# EAGLE design rpi_board (EAGLE 9.3.2)
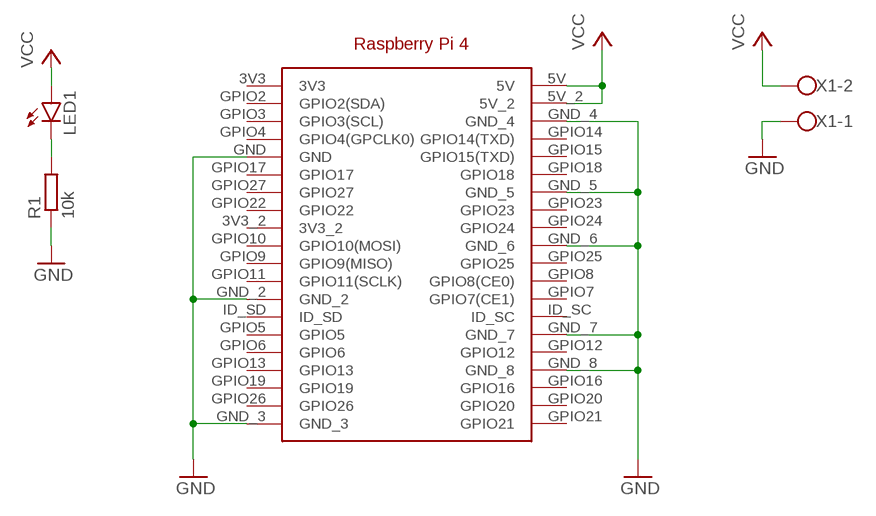
[diagram p0: schematic, sheet 1]

## Parts
LED1  LEDSMT1206  [1206]
R1  10k  R-EU_M1206  [M1206]
U$1  RPI_4  [RPI4_FOOTPRINT]
X1  W237-102  [W237-102]

## Nets
GND: R1.1 U$1.GND U$1.GND_2 U$1.GND_3 U$1.GND_4 U$1.GND_5 U$1.GND_6 U$1.GND_7 U$1.GND_8 X1.1
N$2: LED1.C R1.2
VCC: LED1.A U$1.5V U$1.5V_2 X1.2
Unconnected: U$1.3V3 U$1.3V3_2 U$1.GPIO2(GPIO2(SDA)) U$1.GPIO3(GPIO3(SCL)) U$1.GPIO4(GPIO4(GPCLK0)) U$1.GPIO5 U$1.GPIO6 U$1.GPIO7(GPIO7(CE1)) U$1.GPIO8(GPIO8(CE0)) U$1.GPIO9(GPIO9(MISO)) U$1.GPIO10(GPIO10(MOSI)) U$1.GPIO11(GPIO11(SCLK)) U$1.GPIO12 U$1.GPIO13 U$1.GPIO14(GPIO14(TXD)) U$1.GPIO15(GPIO15(TXD)) U$1.GPIO16 U$1.GPIO17 U$1.GPIO18 U$1.GPIO19 U$1.GPIO20 U$1.GPIO21 U$1.GPIO22 U$1.GPIO23 U$1.GPIO24 U$1.GPIO25 U$1.GPIO26 U$1.GPIO27 U$1.ID_SC U$1.ID_SD

## Library data of the parts
LED1 = led:LED: LED OSRAM: - CHIPLED LG R971, LG N971, LY N971, LG Q971, LY Q971, LO R971, LY R971 LH N974, LH R974 LS Q976, LO Q976, LY Q976 LO Q996 - Hyper CHIPLED LW Q18S LB Q993, LB Q99A, LB R99A - SideLED LS A670, LO A670, LY A670, LG A670, LP A670 LB A673, LV A673, LT A673, LW A673 LH A674 LY A675 LS A676, LA A676, LO A676, LY A676, LW A676 LS A679, LY A679, LG A679 - Hyper Micro SIDELED® LS Y876, LA Y876, LO Y876, LY Y876 LT Y87S - SmartLED LW L88C, LW L88S LB L89C, LB L89S, LG L890 LS L89K, LO L89K, LY L89K LS L896, LA L896, LO L896, LY L896 - TOPLED LS T670, LO T670, LY T670, LG T670, LP T670 LSG T670, LSP T670, LSY T670, LOP T670, LYG T670 LG T671, LOG T671, LSG T671 LB T673, LV T673, LT T673, LW T673 LH T674 LS T676, LA T676, LO T676, LY T676, LB T676, LH T676, LSB T676, LW T676 LB T67C, LV T67C, LT T67C, LS T67K, LO T67K, LY T67K, LW E67C LS E67B, LA E67B, LO E67B, LY E67B, LB E67C, LV E67C, LT E67C LW T67C LS T679, LY T679, LG T679 LS T770, LO T770, LY T770, LG T770, LP T770 LB T773, LV T773, LT T773, LW T773 LH T774 LS E675, LA E675, LY E675, LS T675 LS T776, LA T776, LO T776, LY T776, LB T776 LHGB T686 LT T68C, LB T68C - Hyper Mini TOPLED® LB M676 - Mini TOPLED Santana® LG M470 LS M47K, LO M47K, LY M47K Source: http://www.osram.convergy.de LUXEON: - LUMILED® LXK2-PW12-R00, LXK2-PW12-S00, LXK2-PW14-U00, LXK2-PW14-V00 LXK2-PM12-R00, LXK2-PM12-S00, LXK2-PM14-U00 LXK2-PE12-Q00, LXK2-PE12-R00, LXK2-PE12-S00, LXK2-PE14-T00, LXK2-PE14-U00 LXK2-PB12-K00, LXK2-PB12-L00, LXK2-PB12-M00, LXK2-PB14-N00, LXK2-PB14-P00, LXK2-PB14-Q00 LXK2-PR12-L00, LXK2-PR12-M00, LXK2-PR14-Q00, LXK2-PR14-R00 LXK2-PD12-Q00, LXK2-PD12-R00, LXK2-PD12-S00 LXK2-PH12-R00, LXK2-PH12-S00 LXK2-PL12-P00, LXK2-PL12-Q00, LXK2-PL12-R00 Source: www.luxeon.com KINGBRIGHT: KA-3528ASYC Source: www.kingbright.com
R1 = rcl:R-EU_: RESISTOR, European symbol; SPICEPREFIX: R
U$1 = rpi4:RPI_4
X1 = con-wago-500:W237-102: WAGO SCREW CLAMP; MPN: 237-102; OC_FARNELL: unknown; OC_NEWARK: 70K9898

## Board
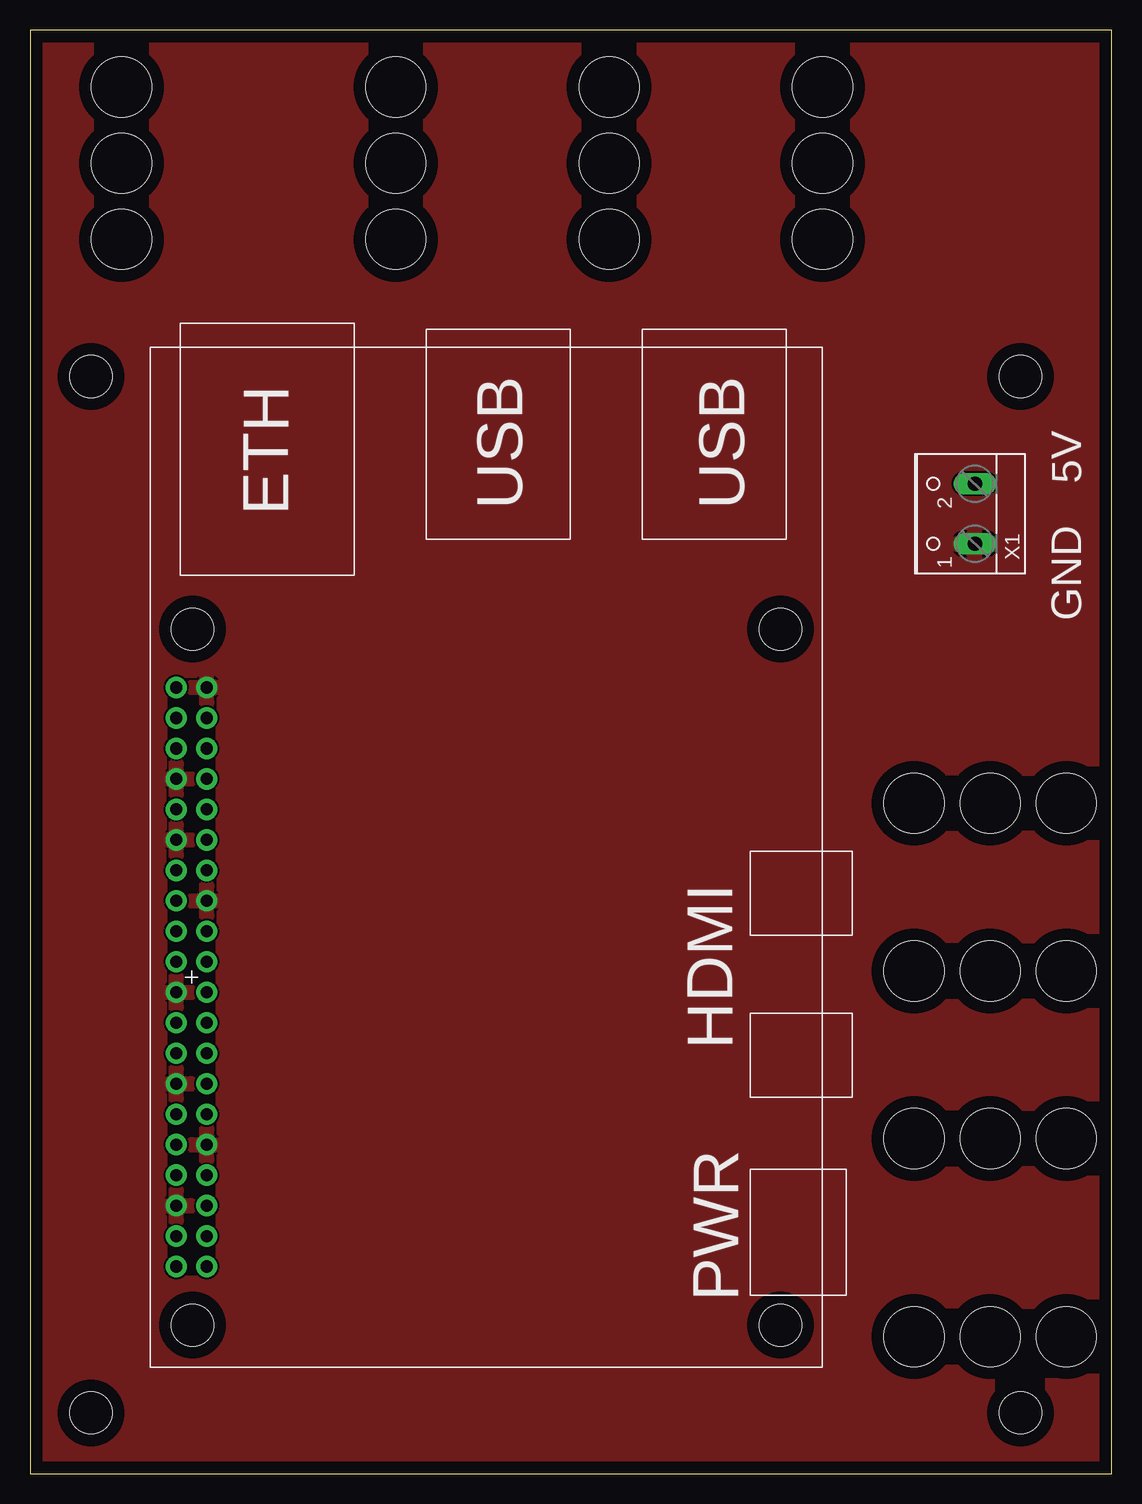
[diagram p1: board, top side]
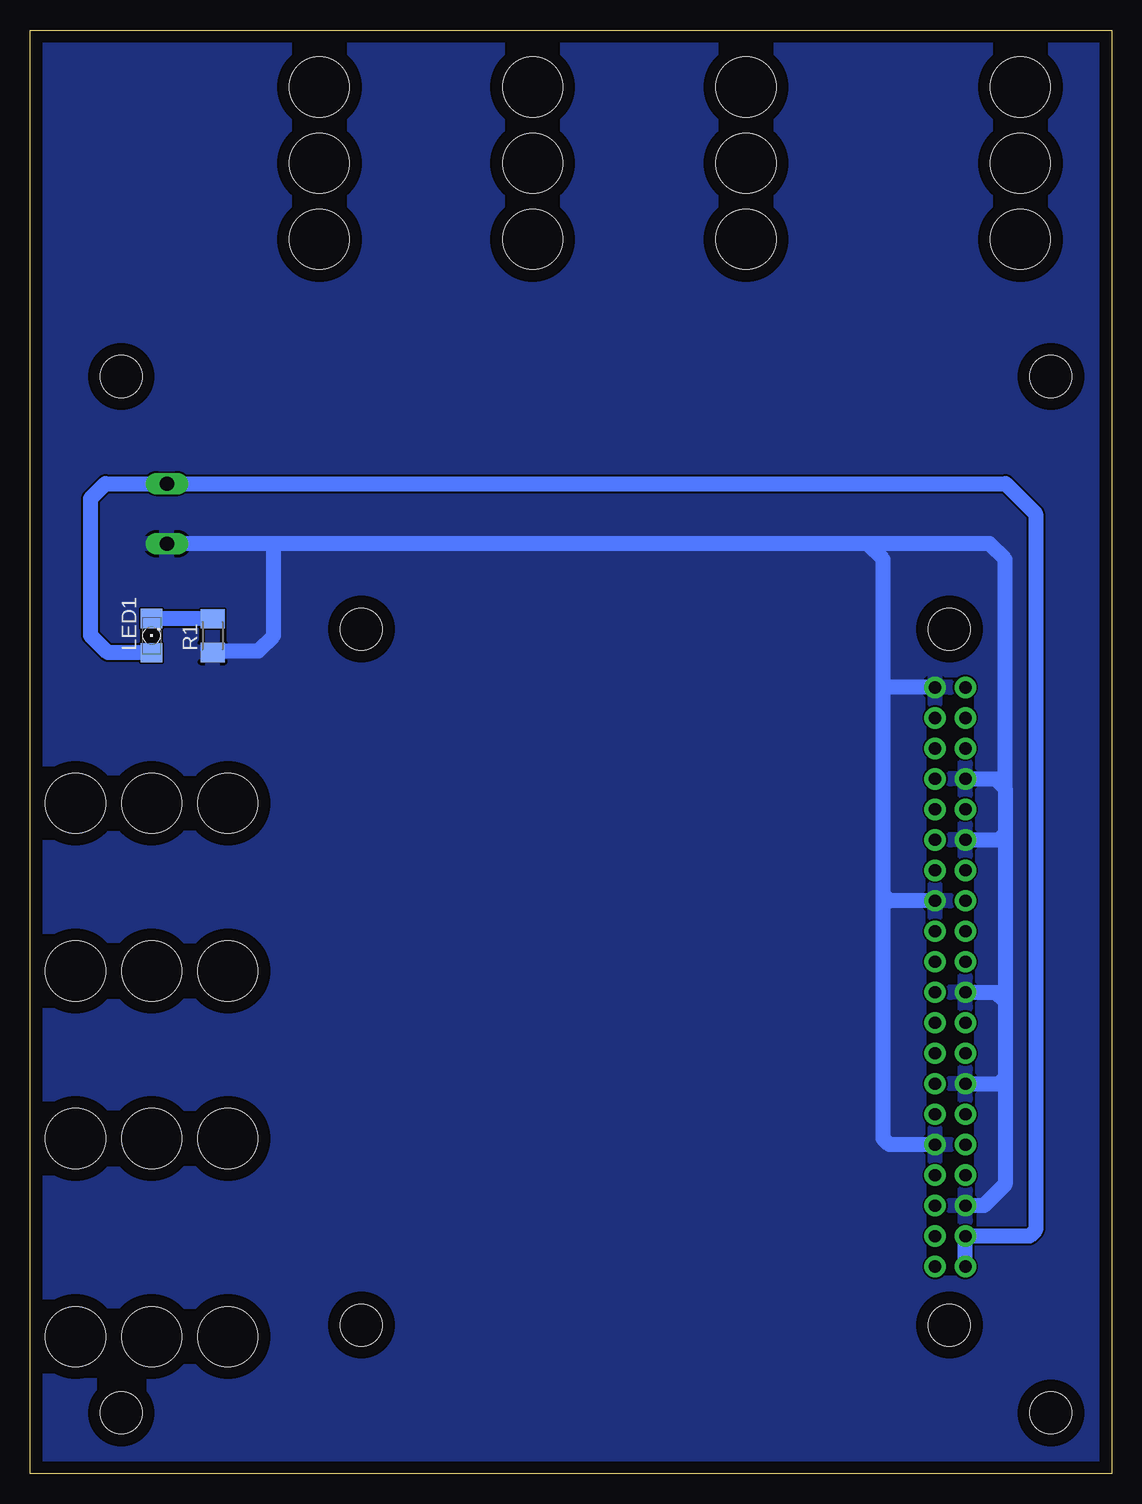
[diagram p2: board, bottom side, seen from below]

Size 90.15 x 120.32 mm. Coordinates in mm from the lower left corner, seen from the top.
Outline: 0,0 90.15,0 90.15,120.32 0,120.32 0,0
Copper layers (1*16): Top 0.035mm / dielectric 1.5mm / Bottom 0.035mm
Design rules "default": minimum track width 6mil, minimum drill 0.35mm, track to track 6mil, track to pad 6mil, pad to pad 6mil, via to via 6mil, smd to smd 6mil, copper to edge 40mil, drill to drill 6mil, minimum pad ring 10mil, minimum via ring 8mil, stop-mask expansion 4mil, vias tented up to drill 0mil, thermal gap 10mil
Holes 5 mm at 73.66,41.91 80.01,41.91 86.36,41.91 73.66,27.94 80.01,27.94 86.36,27.94 73.66,11.43 80.01,11.43 86.36,11.43 73.66,55.88 80.01,55.88 86.36,55.88 30.48,102.87 30.48,109.22 30.48,115.57 48.26,102.87 48.26,109.22 48.26,115.57 66.04,102.87 66.04,109.22 66.04,115.57 7.62,102.87 7.62,109.22 7.62,115.57
Holes 3.5 mm at 5.08,91.44 5.08,5.08 82.55,5.08 82.55,91.44

### Footprints (pad centres in the part's own frame; a part is rotated, then mirrored left to right if it is on the bottom)
1206 = smd 1.6 x 1.803: A -1.422,0; C 1.422,0
M1206 = smd 1.6 x 2: 1 -1.4,0; 2 1.4,0
RPI4_FOOTPRINT = drill 1.016 pad 1.778: 3V3 8.382,51.308; 3V3_2 28.702,51.308; 5V 8.382,53.848; 5V_2 10.922,53.848; GND 18.542,51.308; GND_2 38.862,51.308; GND_3 56.642,51.308; GND_4 13.462,53.848; GND_5 23.622,53.848; GND_6 31.242,53.848; GND_7 43.942,53.848; GND_8 49.022,53.848; GPIO2 10.922,51.308; GPIO3 13.462,51.308; GPIO4 16.002,51.308; GPIO5 43.942,51.308; GPIO6 46.482,51.308; GPIO7 38.862,53.848; GPIO8 36.322,53.848; GPIO9 33.782,51.308; GPIO10 31.242,51.308; GPIO11 36.322,51.308; GPIO12 46.482,53.848; GPIO13 49.022,51.308; GPIO14 16.002,53.848; GPIO15 18.542,53.848; GPIO16 51.562,53.848; GPIO17 21.082,51.308; GPIO18 21.082,53.848; GPIO19 51.562,51.308; GPIO20 54.102,53.848; GPIO21 56.642,53.848; GPIO22 26.162,51.308; GPIO23 26.162,53.848; GPIO24 28.702,53.848; GPIO25 33.782,53.848; GPIO26 54.102,51.308; GPIO27 23.622,51.308; ID_SC 41.402,53.848; ID_SD 41.402,51.308 | hole 3.5: 3.5,3.5; 3.5,52.5; 61.5,52.5; 61.5,3.5
W237-102 = drill 1.194 long: 1 -2.5,-1.27; 2 2.5,-1.27

### Placement (x,y rotation side)
LED1  80.01,69.85 90 bottom
R1  74.93,69.85 90 bottom
U$1  66.04,8.89 90 top
X1  77.47,80.01 90 top

### Tracks (layer width: path | path; a pad name or v marks a point on that pad's centre or on a via)
GND
  Bottom 1.27: U$1.GND_8 9.65,57.91 8.89,57.15 | 8.89,57.15 8.89,53.34 | 8.89,53.34 8.89,39.37 | 8.89,39.37 8.89,33.02 | 8.89,33.02 8.89,24.13 10.67,22.35 U$1.GND_4 | U$1.GND_6 9.65,40.13 8.89,39.37 | U$1.GND_5 9.4,32.51 8.89,33.02 | U$1.GND_3 19.05,65.53 | 20.36,77.51 69.85,77.51 | 69.85,77.51 X1.1 | 20.36,77.51 19.05,76.2 19.05,65.53 | U$1.GND_2 18.54,47.75 19.05,48.26 | 19.05,48.26 19.05,65.53 | U$1.GND 18.54,27.43 19.05,27.94 19.05,48.26 | U$1.GND_7 9.4,52.83 8.89,53.34 | 8.89,57.15 8.89,76.2 10.2,77.51 20.36,77.51 | R1.1 74.8,68.58 71.12,68.58 69.85,69.85 69.85,77.51
  pour Top: 0,0 90.17,0 90.17,120.65 0,120.65
  pour Bottom: 0,0 90.17,0 90.17,120.65 0,120.65
N$2
  Bottom 1.27: R1.2 79.99,71.25 LED1.C
VCC
  Bottom 1.27: U$1.5V U$1.5V_2 6.86,19.81 6.35,20.32 6.35,80.01 8.85,82.51 X1.2 83.86,82.51 85.09,81.28 85.09,69.85 83.67,68.43 LED1.A

### Text on the board
tNames: 5V | GND